# Altium schematic sheet face_board.SchDoc
size A3
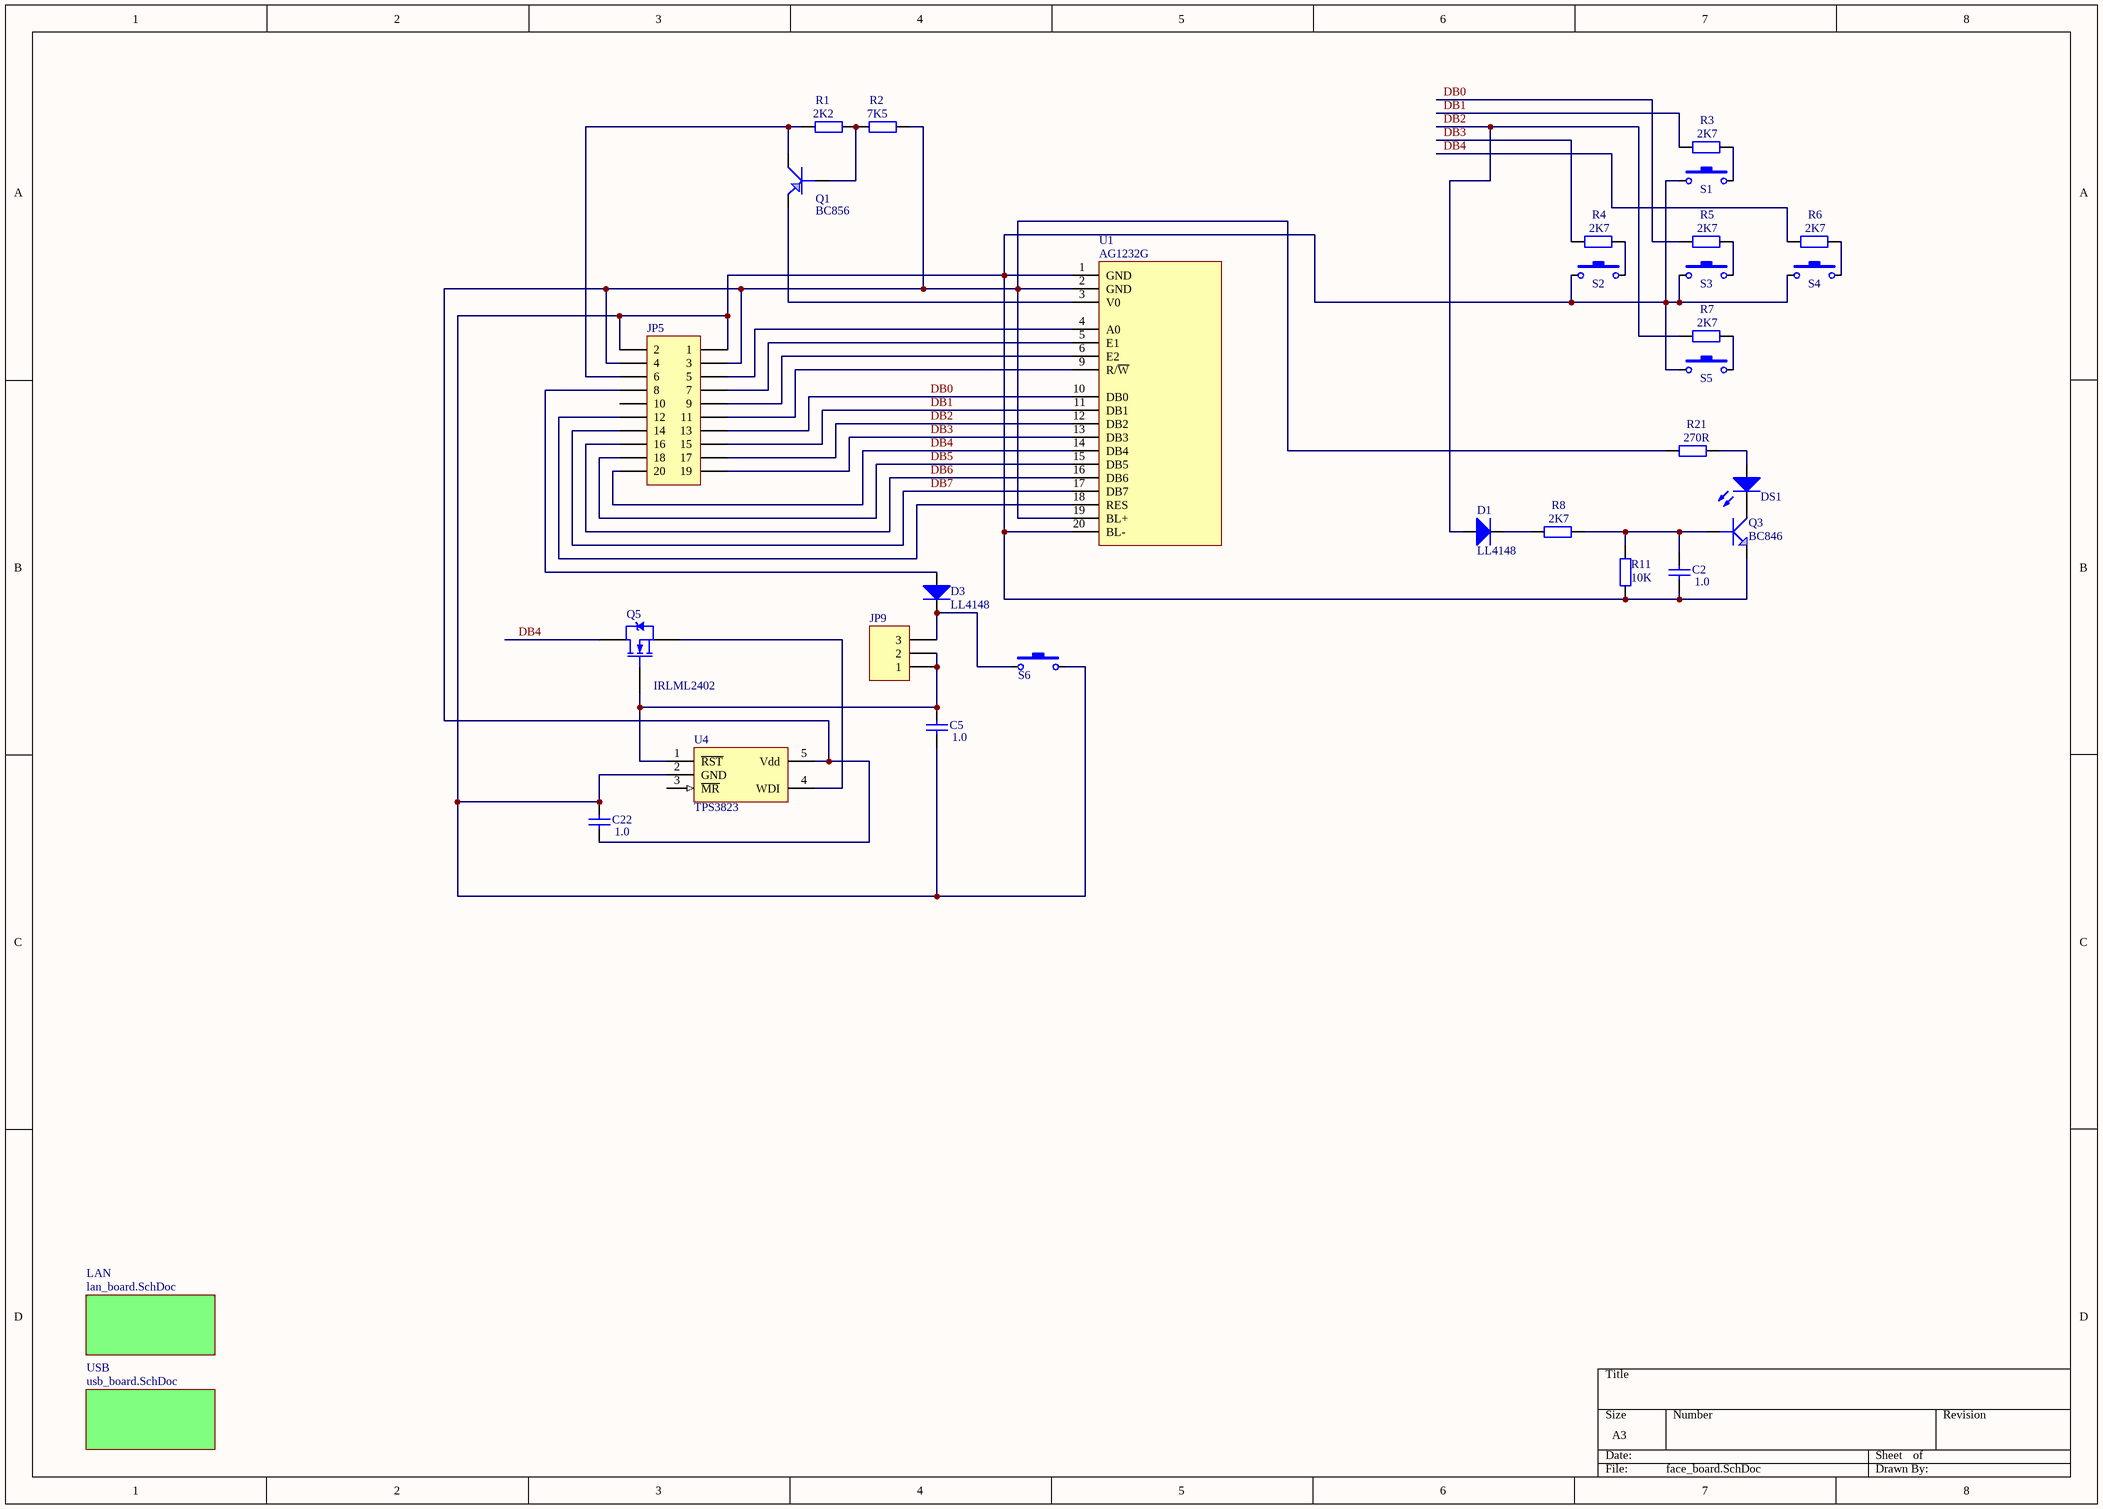
[diagram p0: face_board.SchDoc]

## Parts
C2  1.0  [_1206]
C5  1.0  [_1206]
C22  1.0  [_1206]
D1  LL4148  [_1206d]
D3  LL4148  [_1206d]
DS1  LED0  [el3]  (value not drawn)
JP5  PLHD-20  [HDR2X10]  (value not drawn)
JP9  PLS-3  [HDR1X3]  (value not drawn)
Q1  BC856  [SO-G3]
Q3  BC846  [SO-G3]
Q5  IRLML2402  [SO-G3]
R1  2K2  [_1206]
R2  7K5  [_1206]
R3  2K7  [_1206]
R4  2K7  [_1206]
R5  2K7  [_1206]
R6  2K7  [_1206]
R7  2K7  [_1206]
R8  2K7  [_1206]
R11  10K  [_1206]
R21  270R  [_1206]
S1  SWT-9  [SWT-9]  (value not drawn)
S2  SWT-9  [SWT-9]  (value not drawn)
S3  SWT-9  [SWT-9]  (value not drawn)
S4  SWT-9  [SWT-9]  (value not drawn)
S5  SWT-9  [SWT-9]  (value not drawn)
S6  SWT-6  [SWT-6]  (value not drawn)
U1  AG1232G  [AG1232G]
U4  TPS3823  [SO-G5/P.95]

## Sub-sheets
LAN = lan_board.SchDoc: no entries
USB = usb_board.SchDoc: no entries

## Nets
DB0: JP5.13 R5.2 U1.10(DB0)
DB1: JP5.15 R3.2 U1.11(DB1)
DB2: D1.1(A) JP5.17 R7.2 U1.12(DB2)
DB3: JP5.19 R4.2 U1.13(DB3)
DB4: JP5.20 Q5.3(D) R6.2 U1.14(DB4)
DB5: JP5.18 U1.15(DB5)
DB6: JP5.16 U1.16(DB6)
DB7: JP5.14 U1.17(DB7)
NetC2_1: C2.1 C5.1 C22.2 JP5.1 JP5.2 Q3.2(E) R11.2 S1.1 S2.1 S3.1 S4.1 S5.1 S6.2 U1.1(GND) U1.20(BL-) U4.2(GND)
NetC2_2: C2.2 Q3.1(B) R8.1 R11.1
NetC5_2: C5.2 JP9.1 JP9.2 Q5.1(G) U4.1(~{RST})
NetC22_1: C22.1 JP5.3 JP5.4 R2.2 R21.2 U1.2(GND) U1.19(BL+) U4.5(Vdd)
NetD1_2: D1.2(K) R8.2
NetD3_1: D3.1(A) JP5.8
NetD3_2: D3.2(K) JP9.3 S6.1
NetDS1_1: DS1.1(A) R21.1
NetDS1_2: DS1.2(K) Q3.3(C)
NetJP5_5: JP5.5 U1.4(A0)
NetJP5_6: JP5.6 Q1.3(C) R1.1
NetJP5_7: JP5.7 U1.5(E1)
NetJP5_9: JP5.9 U1.6(E2)
NetJP5_11: JP5.11 U1.9(R/~{W})
NetJP5_12: JP5.12 U1.18(RES)
NetQ1_1: Q1.1(B) R1.2 R2.1
NetQ1_2: Q1.2(E) U1.3(V0)
NetQ5_2: Q5.2(S) U4.4(WDI)
NetR3_1: R3.1 S1.2
NetR4_1: R4.1 S2.2
NetR5_1: R5.1 S3.2
NetR6_1: R6.1 S4.2
NetR7_1: R7.1 S5.2

Not connected (* = marked no-connect by the designer): JP5 10; U4 3(~{MR})

## Library data of the parts
C2 C5 C22 = Cap Semi: Capacitor; Manufacturer: Generic Components; Class I: Passive; Value: 0,1; Published: 8-Jun-2000; Revision: July-2002: Re-released for DXP Platform.; Publisher: Altium Limited; Class II: Capacitor
D1 D3 = Diode: Manufacturer: Generic Components; Class I: Discrete; Class II: Diode - Switching; Published: 8-Jun-2000; Revision: July-2002: Re-released for DXP Platform.; Publisher: Altium Limited; Value: LL4148
DS1 = LED0: Typical INFRARED GaAs LED; Manufacturer: Generic Components; Class I: Optoelectronic; Published: 8-Jun-2000; Revision: July-2002: Re-released for DXP Platform.; Publisher: Altium Limited; Class II: LED
JP5 = Header 10X2: Header, 10-Pin, Dual row; Manufacturer: Generic Components; Class I: Connector; Revision: July-2002: Re-released for DXP Platform.; Publisher: Altium Limited
JP9 = Header 3: Header, 3-Pin; Manufacturer: Generic Components; Class I: Connector; Revision: July-2002: Re-released for DXP Platform.; Publisher: Altium Limited
Q1 = GT109: Bipolar transistor; Right: 20; Bottom: 20; Value: BC856
Q3 = GT122: Bipolar transistor; Right: 20; Bottom: 20; Value: BC846
Q5 = IRLML2402: HEXFET Power MOSFET; Manufacturer: International Rectifier; Class I: Discrete; Class II: MOSFET - Power; Published: 8-Jun-2000; Revision: July-2002: Re-released for DXP Platform.; Datasheet: Latest Revision: Aug-1997; Package Reference: SOT-23; Publisher: Altium Limited; Value: IRLML2402
R1-R8 = Res2: Resistor; Manufacturer: Generic Components; Class I: Passive; Rule: Undefined; Published: 8-Jun-2000; Revision: July-2002: Re-released for DXP Platform.; Publisher: Altium Limited; Class II: Resistor
  R1: Value: 2K2
  R2: Value: 7K5
  R3-R8: Value: 2K7
R11 R21 = Res2: Resistor; Manufacturer: Generic Components; Class I: Passive; Value: 2K7; Rule: Undefined; Published: 8-Jun-2000; Revision: July-2002: Re-released for DXP Platform.; Publisher: Altium Limited; Class II: Resistor
S1-S6 = SWT-9: Button; Manufacturer: Generic Components; Published: 24-Mar-1999; Revision: July-2002: Re-released for DXP Platform.; Publisher: Altium Limited
  S1-S5: Value: SWT-9
  S6: Value: SWT-6
U1 = AG1232G: LCD; Value: AG1232G
U4 = TPS3823: Reset IC; Manufacturer: National Semiconductor; Package Information: Latest Revision: Aug-1999; Class I: Power Management; Class II: Voltage Regulator; Value: TPS76333; Published: 15-Apr-2002; Datasheet: Latest Revision: Oct-1999; Package Reference: MA05B; Publisher: Altium Limited